# EAGLE design buck_converters (EAGLE 9.6.2)
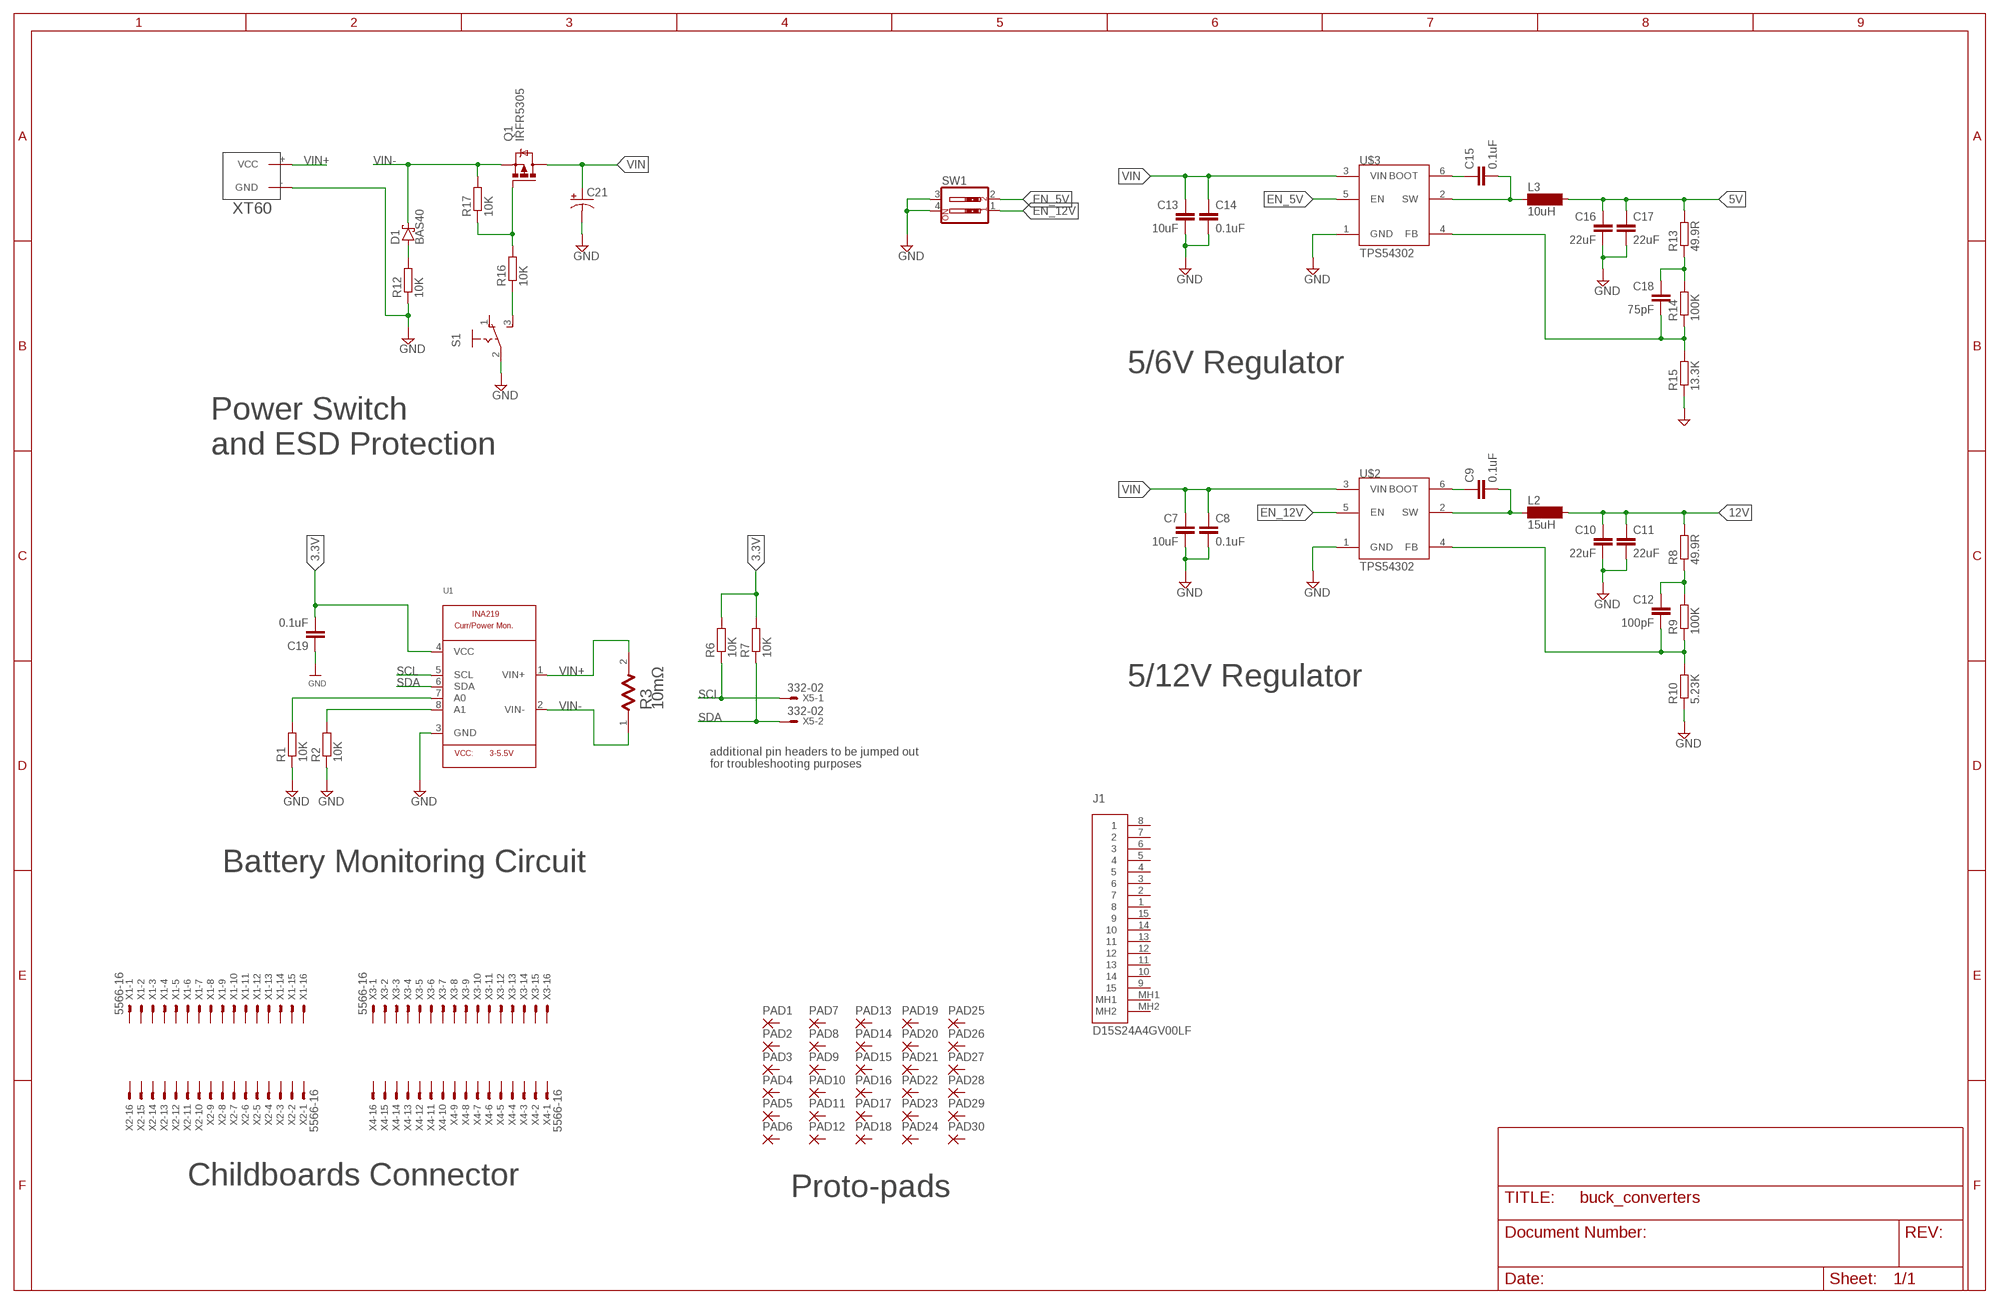
[diagram p0: schematic, sheet 1]

## Parts
C7  10uF  C-EUC0805  [C0805]
C8  0.1uF  C-EUC0805  [C0805]
C9  0.1uF  C-EUC0805  [C0805]
C10  22uF  C-EUC0805  [C0805]
C11  22uF  C-EUC0805  [C0805]
C12  100pF  C-EUC0805  [C0805]
C13  10uF  C-EUC0805  [C0805]
C14  0.1uF  C-EUC0805  [C0805]
C15  0.1uF  C-EUC0805  [C0805]
C16  22uF  C-EUC0805  [C0805]
C17  22uF  C-EUC0805  [C0805]
C18  75pF  C-EUC0805  [C0805]
C19  0.1uF  C-EUC0805  [C0805]
C21  CPOL-US153CLV-1010  [153CLV-1010]
D1  BAS40  [SOT23]
J1  D15S24A4GV00LF  [D15S24A4GV00LF]
L2  15uH  SM-NE29  [SM-NE29]
L3  10uH  SM-NE29  [SM-NE29]
PAD1  2,15/1,0  [2,15/1,0]
PAD2  2,15/1,0  [2,15/1,0]
PAD3  2,15/1,0  [2,15/1,0]
PAD4  2,15/1,0  [2,15/1,0]
PAD5  2,15/1,0  [2,15/1,0]
PAD6  2,15/1,0  [2,15/1,0]
PAD7  2,15/1,0  [2,15/1,0]
PAD8  2,15/1,0  [2,15/1,0]
PAD9  2,15/1,0  [2,15/1,0]
PAD10  2,15/1,0  [2,15/1,0]
PAD11  2,15/1,0  [2,15/1,0]
PAD12  2,15/1,0  [2,15/1,0]
PAD13  2,15/1,0  [2,15/1,0]
PAD14  2,15/1,0  [2,15/1,0]
PAD15  2,15/1,0  [2,15/1,0]
PAD16  2,15/1,0  [2,15/1,0]
PAD17  2,15/1,0  [2,15/1,0]
PAD18  2,15/1,0  [2,15/1,0]
PAD19  2,15/1,0  [2,15/1,0]
PAD20  2,15/1,0  [2,15/1,0]
PAD21  2,15/1,0  [2,15/1,0]
PAD22  2,15/1,0  [2,15/1,0]
PAD23  2,15/1,0  [2,15/1,0]
PAD24  2,15/1,0  [2,15/1,0]
PAD25  2,15/1,0  [2,15/1,0]
PAD26  2,15/1,0  [2,15/1,0]
PAD27  2,15/1,0  [2,15/1,0]
PAD28  2,15/1,0  [2,15/1,0]
PAD29  2,15/1,0  [2,15/1,0]
PAD30  2,15/1,0  [2,15/1,0]
Q1  IRFR5305  [D-PAK_TO252AA]
R1  10K  R-EU_R0805  [R0805]
R2  10K  R-EU_R0805  [R0805]
R3  VISHAY_WSHP2818R0100FEAVISHAY_WSHP2818R0100FEA_0_0  [VISHAY_WSHP2818R0100FEA_0]
R6  10K  R-EU_R0805  [R0805]
R7  10K  R-EU_R0805  [R0805]
R8  49.9R  R-EU_R0805  [R0805]
R9  100K  R-EU_R0805  [R0805]
R10  5.23K  R-EU_R0805  [R0805]
R12  10K  R-EU_R0805  [R0805]
R13  49.9R  R-EU_R0805  [R0805]
R14  100K  R-EU_R0805  [R0805]
R15  13.3K  R-EU_R0805  [R0805]
R16  10K  R-EU_R0805  [R0805]
R17  10K  R-EU_R0805  [R0805]
S1  255SB  [255SB]
SW1  SW_DIP-2  [EDG-02]
U1  INA219  [SOT23-8]
U$2  TPS54302  [SOT23-6]
U$3  TPS54302  [SOT23-6]
U$9  XT60  [XT60]
X1  5566-16  [5566-16]
X2  5566-16  [5566-16]
X3  5566-16  [5566-16]
X4  5566-16  [5566-16]
X5  332-02  [332-02]

## Nets
3.3V: C19.2 R6.2 R7.2 U1.4(VCC)
5V: C16.1 C17.1 L3.2 R13.2
12V: C10.1 C11.1 L2.2 R8.2
EN_5V: U$3.5(EN)
EN_12V: U$2.5(EN)
GND: C7.2 C8.2 C10.2 C11.2 C13.2 C14.2 C16.2 C17.2 C19.1 C21.- R1.1 R2.1 R10.1 R12.1 R15.1 S1.2(P) SW1.3 SW1.4 U1.3(GND) U$2.1(GND) U$3.1(GND) U$9.-(GND)
N$2: SW1.2
N$3: R2.2 U1.8(A1)
N$4: SW1.1
N$6: C12.1 R8.1 R9.2
N$7: C12.2 R9.1 R10.2 U$2.4(FB)
N$8: R1.2 U1.7(A0)
N$9: C9.1 U$2.6(BOOT)
N$10: C9.2 L2.1 U$2.2(SW)
N$11: C18.1 R13.1 R14.2
N$12: C18.2 R14.1 R15.2 U$3.4(FB)
N$14: C15.1 U$3.6(BOOT)
N$15: C15.2 L3.1 U$3.2(SW)
N$16: D1.1(A) R12.2
N$17: R16.1 S1.3(S)
N$18: Q1.1(G) R16.2 R17.1
SCL: R6.1 U1.5(SCL) X5.1
SDA: R7.1 U1.6(SDA) X5.2
VIN: C7.1 C8.1 C13.1 C14.1 C21.+ Q1.4(D) U$2.3(VIN) U$3.3(VIN)
VIN+: R3.2 U1.1(VIN+) U$9.+(VCC)
VIN-: D1.3(C) Q1.3(S) R3.1 R17.2 U1.2(VIN-)
Unconnected: J1.1 J1.2 J1.3 J1.4 J1.5 J1.6 J1.7 J1.8 J1.9 J1.10 J1.11 J1.12 J1.13 J1.14 J1.15 J1.MH1 J1.MH2 PAD1.1(P) PAD2.1(P) PAD3.1(P) PAD4.1(P) PAD5.1(P) PAD6.1(P) PAD7.1(P) PAD8.1(P) PAD9.1(P) PAD10.1(P) PAD11.1(P) PAD12.1(P) PAD13.1(P) PAD14.1(P) PAD15.1(P) PAD16.1(P) PAD17.1(P) PAD18.1(P) PAD19.1(P) PAD20.1(P) PAD21.1(P) PAD22.1(P) PAD23.1(P) PAD24.1(P) PAD25.1(P) PAD26.1(P) PAD27.1(P) PAD28.1(P) PAD29.1(P) PAD30.1(P) S1.1(O) X1.1 X1.2 X1.3 X1.4 X1.5 X1.6 X1.7 X1.8 X1.9 X1.10 X1.11 X1.12 X1.13 X1.14 X1.15 X1.16 X2.1 X2.2 X2.3 X2.4 X2.5 X2.6 X2.7 X2.8 X2.9 X2.10 X2.11 X2.12 X2.13 X2.14 X2.15 X2.16 X3.1 X3.2 X3.3 X3.4 X3.5 X3.6 X3.7 X3.8 X3.9 X3.10 X3.11 X3.12 X3.13 X3.14 X3.15 X3.16 X4.1 X4.2 X4.3 X4.4 X4.5 X4.6 X4.7 X4.8 X4.9 X4.10 X4.11 X4.12 X4.13 X4.14 X4.15 X4.16

## Notes on the sheet
- 5/6V Regulator
- Power Switch
  and ESD Protection
- 5/12V Regulator
- additional pin headers to be jumped out 
  for troubleshooting purposes
- Battery Monitoring Circuit
- Childboards Connector
- Proto-pads

## Library data of the parts
C7-C19 = rcl:C-EU: CAPACITOR, European symbol; SPICEPREFIX: C
C21 = rcl:CPOL-US: POLARIZED CAPACITOR, American symbol; SPICEPREFIX: C
D1 = diode:BAS40: Silicon Schottky Diodes General-purpose diode for high-speed switching
J1 = D-Sub Connectors:D15S24A4GV00LF: CONN D-SUB RCPT 15POS VERT SLDR Manufacturer's datasheet <https://www.amphenol-icc.com/media/wysiwyg/files/drawing/c01-8646-0815.pdf>; CREATED_BY: PCBLayout.com; DIGIKEY_PART_NUMBER: 609-1497-ND; MANUFACTURER: Amphenol ICC (FCI); MPN: D15S24A4GV00LF
L2 L3 = inductor-neosid:SM-NE29: INDUCTOR SMD chip inductor; OC_FARNELL: unknown; OC_NEWARK: unknown
PAD1-PAD30 = wirepad:2,15/1,0: THROUGH-HOLE PAD
Q1 = transistor-power:IRF?5305: HEXFET Power MOSFET Source: http://www.irf.com/product-info/datasheets/data/irfr5305pbf.pdf
R1 R2 R6-R10 R12-R17 = rcl:R-EU_: RESISTOR, European symbol; SPICEPREFIX: R
R3 = Vishay - WSHP2818R0100FEA:VISHAY_WSHP2818R0100FEA: RES 0.01 OHM 1% 10W 2818; AUTOMOTIVE: Yes; AUTOMOTIVE_GRADE: Grade 0; CENTROID_NOT_SPECIFIED: No; COMPOSITION: Metal Element; DATASHEET: https://www.vishay.com/docs/30347/wshp2818.pdf; DEVICE_CLASS_L1: Passive Components; DEVICE_CLASS_L2: Resistors; DEVICE_CLASS_L3: Chip SMD Resistors; DIGIKEY_DESCRIPTION: RES 0.01 OHM 1% 10W 2818; DIGIKEY_PART_NUMBER: 541-3276-1-ND; FOOTPRINT_VARIANT_NAME_0: Recommended_Land_Pattern; HEIGHT: 1.75mm; LEAD_FREE: Yes; MF: Vishay; MFG_PACKAGE_IDENT: WSHP2818; MFG_PACKAGE_IDENT_DATE: 0; MFG_PACKAGE_IDENT_REV: 0; MOUSER_PART_NUMBER: 71-WSHP2818R0100FEA; MPN: WSHP2818R0100FEA; PACKAGE: 2818; POWER_RATING: 10W; PREFIX: R; RESISTANCE: 10mΩ; ROHS: Yes; SERIES: WSHP; TEMPERATURE_COEFFICIENT: 75ppm/°C; TEMPERATURE_RANGE_HIGH: +170°C; TEMPERATURE_RANGE_LOW: -65°C; TOLERANCE: 1%; VERIFICATION_VERSION: 0.0.0.3
S1 = switch:255SB: SLIDING SWITCH Distributor Buerklin, 11G810
SW1 = special:SW_DIP-2: DIP SWITCH
U1 = INA219:INA219: INA219 - I2C Current/Power Monitor Voltage Range: 0-26V Accuracy: 0.5% Temperature: -40°C - 125°C
U$2 U$3 = TPSxxxxxx-buck-regulators:TPS54302
U$9 = XT60:XT60: XT60
X1-X4 = con-molex:5566-16: Mini FIT connector 16 pol Source: http://www.molex.com; MF: MOLEX; OC_FARNELL: unknown; OC_NEWARK: unknown
X5 = con-garry:332-02: 2 Pin - 2mm Dual Row Source: www.mpe-connector.de / garry_shortform_2012.pdf

## Board
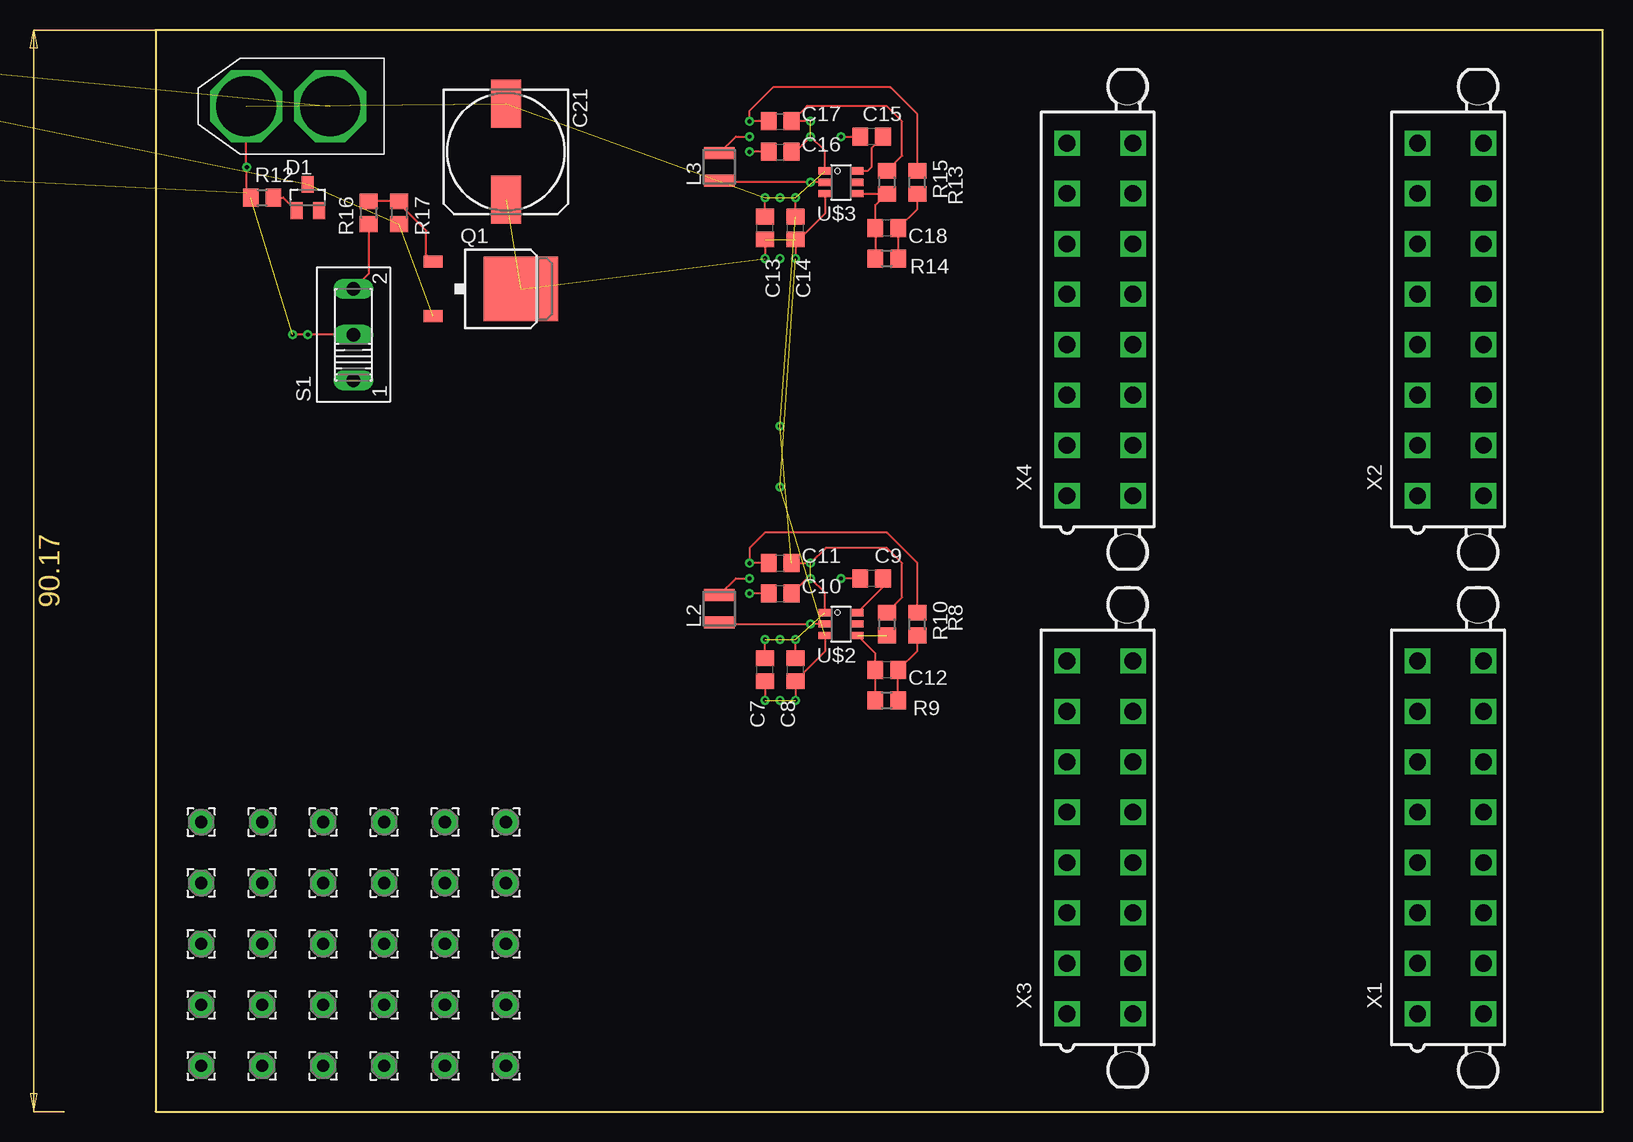
[diagram p1: board, top side]
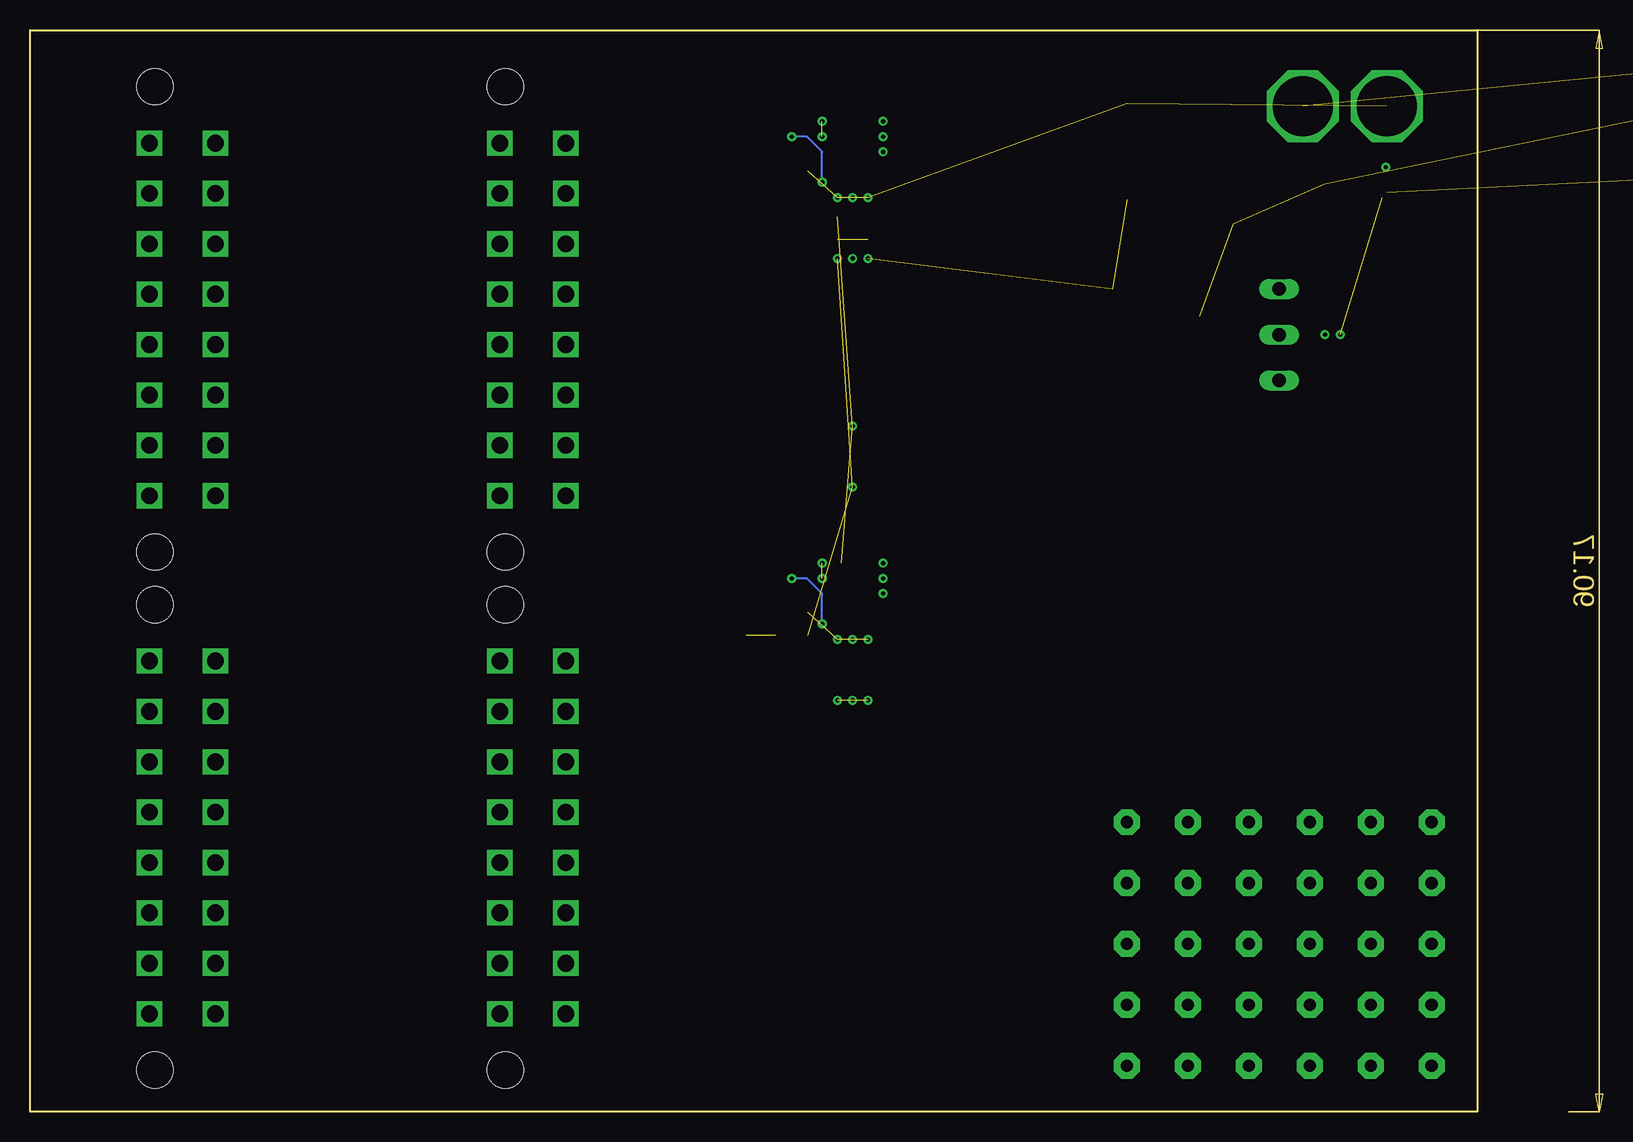
[diagram p2: board, bottom side, seen from below]

Size 120.65 x 90.17 mm. Coordinates in mm from the lower left corner, seen from the top.
Outline: 0,90.17 0,0 120.65,0 120.65,90.17 0,90.17
Copper layers (1*16): Top 0.035mm / dielectric 1.5mm / Bottom 0.035mm
Design rules "default": minimum track width 6mil, minimum drill 0.35mm, track to track 6mil, track to pad 6mil, pad to pad 6mil, via to via 6mil, smd to smd 6mil, copper to edge 40mil, drill to drill 6mil, minimum pad ring 10mil, minimum via ring 8mil, stop-mask expansion 4mil, vias tented up to drill 0mil, thermal gap 10mil

### Footprints (pad centres in the part's own frame; a part is rotated, then mirrored left to right if it is on the bottom)
C0805 = smd 1.3 x 1.5: 1 -0.95,0; 2 0.95,0
153CLV-1010 = smd 4 x 2.5: + 4,0; - -4,0
SOT23 = smd 1 x 1.4: 1 -0.95,-1.1; 2 0.95,-1.1; 3 0,1.1
D15S24A4GV00LF = drill 0.9 square: 1 9.59,1.42 | drill 0.9: 2 6.85,1.42; 3 4.11,1.42; 4 1.37,1.42; 5 -1.37,1.42; 6 -4.11,1.42; 7 -6.85,1.42; 8 -9.59,1.42; 9 8.22,-1.42; 10 5.48,-1.42; 11 2.74,-1.42; 12 0,-1.42; 13 -2.74,-1.42; 14 -5.48,-1.42; 15 -8.22,-1.42 | drill 3.1: MH1 -16.66,0; MH2 16.66,0
SM-NE29 = smd 1 x 2.54: 1 -1.15,0; 2 1.15,0
2,15/1,0 = drill 1.016 pad 2.159 octagon: 1 0,0
D-PAK_TO252AA = smd 1 x 1.6: 1 -2.28,-4.8; 3 2.28,-4.8 | smd 5.4 x 6.2: 4 0,2.5
R0805 = smd 1.3 x 1.5: 1 -0.95,0; 2 0.95,0
VISHAY_WSHP2818R0100FEA_0 = smd 3.5 x 5.1: 1 -2.055,0; 2 2.055,0
255SB = drill 1.118 long: 1 -3.81,0; 2 0,0; 3 3.81,0
EDG-02 = drill 0.813 long: 1 -1.27,-3.81; 2 1.27,-3.81; 3 1.27,3.81; 4 -1.27,3.81
SOT23-8 = smd 0.4 x 1.2: 1 -0.975,-1.3; 2 -0.325,-1.3; 3 0.325,-1.3; 4 0.975,-1.3; 5 0.975,1.3; 6 0.325,1.3; 7 -0.325,1.3; 8 -0.975,1.3
SOT23-6 = smd 0.6 x 1.05: 1 -0.95,-1.35; 2 0,-1.35; 3 0.95,-1.35; 4 0.95,1.35; 5 0,1.35; 6 -0.95,1.35
XT60 = drill 5 octagon: + 4.5,0; - 11.5,0
5566-16 = drill 1.4 square: 1 14.7,-2.75; 2 10.5,-2.75; 3 6.3,-2.75; 4 2.1,-2.75; 5 -2.1,-2.75; 6 -6.3,-2.75; 7 -10.5,-2.75; 8 -14.7,-2.75; 9 14.7,2.75; 10 10.5,2.75; 11 6.3,2.75; 12 2.1,2.75; 13 -2.1,2.75; 14 -6.3,2.75; 15 -10.5,2.75; 16 -14.7,2.75 | hole 3: 19.4,2.29; -19.4,2.29
332-02 = drill 0.9 pad 1.27: 1 0,-1; 2 0,1

### Placement (x,y rotation side)
C7  50.8,36.83 90 top
C8  53.34,36.83 90 top
C9  59.69,44.45 180 top
C10  52.07,43.18 0 top
C11  52.07,45.72 0 top
C12  60.96,36.83 180 top
C13  50.8,73.66 90 top
C14  53.34,73.66 90 top
C15  59.69,81.28 180 top
C16  52.07,80.01 0 top
C17  52.07,82.55 0 top
C18  60.96,73.66 180 top
C19  -41.91,48.26 0 top  (outside the outline)
C21  29.21,80.01 270 top
D1  12.7,76.2 0 top
J1  -48.26,-19.05 0 top  (outside the outline)
L2  46.99,41.91 90 top
L3  46.99,78.74 90 top
PAD1  13.97,24.13 0 top
PAD2  3.81,24.13 0 top
PAD3  3.81,19.05 0 top
PAD4  3.81,13.97 0 top
PAD5  3.81,8.89 0 top
PAD6  3.81,3.81 0 top
PAD7  8.89,8.89 0 top
PAD8  8.89,13.97 0 top
PAD9  8.89,3.81 0 top
PAD10  19.05,24.13 0 top
PAD11  8.89,19.05 0 top
PAD12  8.89,24.13 0 top
PAD13  24.13,24.13 0 top
PAD14  24.13,19.05 0 top
PAD15  24.13,13.97 0 top
PAD16  24.13,8.89 0 top
PAD17  24.13,3.81 0 top
PAD18  13.97,3.81 0 top
PAD19  13.97,19.05 0 top
PAD20  13.97,13.97 0 top
PAD21  19.05,19.05 0 top
PAD22  19.05,13.97 0 top
PAD23  19.05,8.89 0 top
PAD24  19.05,3.81 0 top
PAD25  13.97,8.89 0 top
PAD26  29.21,24.13 0 top
PAD27  29.21,19.05 0 top
PAD28  29.21,13.97 0 top
PAD29  29.21,8.89 0 top
PAD30  29.21,3.81 0 top
Q1  27.94,68.58 270 top
R1  -34.29,78.74 0 top  (outside the outline)
R2  -34.29,72.39 0 top  (outside the outline)
R3  -64.77,-5.08 0 top  (outside the outline)
R6  -34.29,66.04 0 top  (outside the outline)
R7  -34.29,59.69 0 top  (outside the outline)
R8  63.5,40.64 90 top
R9  60.96,34.29 0 top
R10  60.96,40.64 270 top
R12  8.89,76.2 0 top
R13  63.5,77.47 90 top
R14  60.96,71.12 0 top
R15  60.96,77.47 270 top
R16  17.78,74.93 90 top
R17  20.32,74.93 270 top
S1  16.51,64.77 90 top
SW1  -66.04,7.62 0 top  (outside the outline)
U1  -49.53,91.44 0 top  (outside the outline)
U$2  57.15,40.64 270 top
U$3  57.15,77.47 270 top
U$9  19.05,83.82 180 top
X1  107.95,22.86 270 top
X2  107.95,66.04 270 top
X3  78.74,22.86 270 top
X4  78.74,66.04 270 top
X5  -43.18,60.96 0 top  (outside the outline)

### Tracks (layer width: path | path; a pad name or v marks a point on that pad's centre or on a via)
3.3V  (3 unrouted)
5V  (via drill 0.35)
  Top 0.152: C17.1 v49.53,82.55 49.53,83.46 51.47,85.39 61.27,85.39 63.5,83.16 R13.2 63.8,78.72 | C16.1 v49.53,80.01 | L3.2 48.38,81.28 v49.53,81.28
12V  (via drill 0.35)
  Top 0.152: L2.2 48.38,44.45 v49.53,44.45 | C10.1 v49.53,43.18 | C11.1 v49.53,45.72 49.53,46.99 50.8,48.26 60.96,48.26 63.5,45.72 R8.2
GND  (via drill 0.35)  (19 unrouted)
  Top 0.152: U$3.1 55.8,80.09 v54.61,81.28 53.34,80.01 C16.2 | R15.1 62.23,79.69 62.23,82.55 60.96,83.82 54.29,83.82 C17.2 v54.61,82.55 | C13.2 v50.8,76.2 | C14.2 v53.34,76.2 | C11.2 v54.61,45.72 55.88,46.99 60.96,46.99 62.23,45.72 62.23,42.86 R10.1 | C10.2 54.29,44.45 v54.61,44.45 55.8,43.26 U$2.1 | C7.2 v50.8,39.37 | C8.2 v53.34,39.37 | 7.55,76.59 R12.1 7.62,76.52 v7.62,78.74 7.55,78.81 U$9.- | S1.2 v12.7,64.77 v11.43,64.77
  other vias: 52.07,76.2 52.07,57.15 52.07,39.37
N$3  (1 unrouted)
N$6
  Top 0.152: R9.2 C12.1 63.5,38.42 R8.1
N$7  (1 unrouted)
  Top 0.152: R9.1 C12.2 60.01,38.18 U$2.4
N$8  (1 unrouted)
N$9
  Top 0.152: C9.1 60.64,43.73 U$2.6
N$10  (via drill 0.35)
  Top 0.152: C9.2 v57.15,44.45 | U$2.2 v54.61,40.64 47.11,40.64 L2.1
  Bottom 0.152: v54.61,40.64 54.61,43.18 55.88,44.45 v57.15,44.45
N$11
  Top 0.152: R13.1 63.5,75.25 C18.1 R14.2
N$12
  Top 0.152: R14.1 C18.2 60.01,75.57 R15.2 U$3.4
N$14
  Top 0.152: C15.1 59.69,80.33 59.69,78.74 59.37,78.42 U$3.6
N$15  (via drill 0.35)
  Top 0.152: U$3.2 v54.61,77.47 47.11,77.47 L3.1 | v57.15,81.28 C15.2
  Bottom 0.152: v54.61,77.47 54.61,80.01 55.88,81.28 v57.15,81.28
N$16
  Top 0.152: R12.2 10.65,76.2 D1.1
N$17
  Top 0.152: R16.1 17.78,69.85 S1.3
N$18
  Top 0.152: Q1.1 22.57,71.43 22.57,73.45 20.32,75.7 R17.1 R16.2
N$19  (via drill 0.35)
  other vias: 52.07,71.12
SCL  (2 unrouted)
SDA  (2 unrouted)
VIN  (via drill 0.35)  (7 unrouted)
  Top 0.152: C13.1 v50.8,71.12 | C14.1 53.34,72.39 | 53.34,72.39 v53.34,71.12 | U$3.3 55.8,74.85 53.34,72.39 | U$2.3 55.8,38.34 C8.1 v53.34,34.29 | C7.1 v50.8,34.29
  other vias: 52.07,52.07 52.07,34.29
VIN+  (2 unrouted)
VIN-  (4 unrouted)